# Altium schematic sheet LiPo_Charger.SchDoc: Printer
size 431 x 279 mm; Date: 2022; Author: Renaissance; CompanyName: Upenn-ESE516; DrawnBy: Xinyang Tan;  Yuxin Wang; Engineer: Xinyang Tan;  Yuxin Wang; Address1: 200 S 33 St; Address2: Moore Building, Rm 101; Address3: Philadephla, PA 19104; DocumentNumber: 4; Revision: 1.0; SheetNumber: 4; SheetTotal: 9
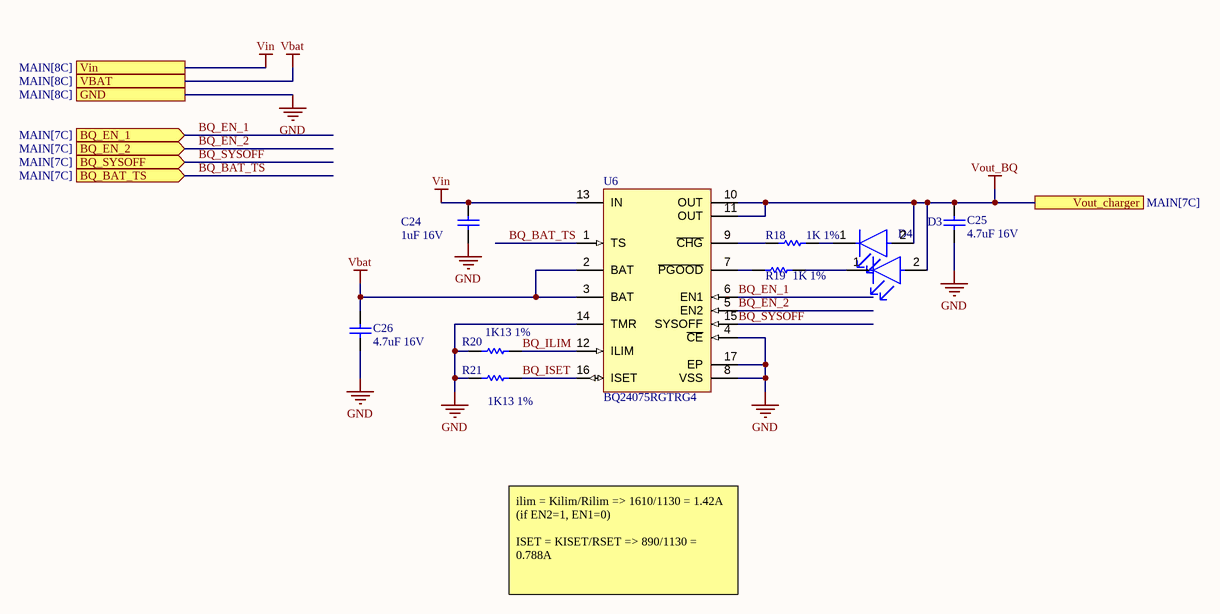
[diagram p0: LiPo_Charger.SchDoc]

## Parts
C24  1uF 16V  [CAPC1608X90X35NL15T15]
C25  4.7uF 16V  [CAPC0805(2012)145_N]
C26  4.7uF 16V  [CAPC0805(2012)145_N]
D3  LTST-C170CKT  [FP-LTST-C170CKT-MFG]  (value not drawn)
D4  LTST-C170GKT  [FP-LTST-C170GKT-MFG]  (value not drawn)
R18  1K 1%  [RESC1609X50X30NL10T20]
R19  1K 1%  [RESC1609X50X30NL10T20]
R20  1K13 1%  [RESC0603(1608)_N]
R21  1K13 1%  [RESC0603(1608)_N]
U6  BQ24075RGTRG4  [RGT16-1700X1700TP]

## Ports
BQ_BAT_TS (in, see MAIN[7C]), BQ_EN_1 (in, see MAIN[7C]), BQ_EN_2 (in, see MAIN[7C]), BQ_SYSOFF (in, see MAIN[7C]), GND (see MAIN[8C]), VBAT (see MAIN[8C]), Vin (see MAIN[8C]), Vout_charger (see MAIN[7C])

## Nets
GND: C24.1 C25.1 C26.2 R20.1 R21.1 U6.4(~{CE}) U6.8(VSS) U6.14(TMR) U6.17(EP) ; port GND
Vbat: C26.1 U6.2(BAT) U6.3(BAT) ; port VBAT
Vin: C24.2 U6.13(IN) ; port Vin
Vout_BQ: C25.2 D3.2(A) D4.2(A) U6.10(OUT) U6.11(OUT) ; port Vout_charger
BQ_BAT_TS: U6.1(TS) ; port BQ_BAT_TS
BQ_EN_1: U6.6(EN1) ; port BQ_EN_1
BQ_EN_2: U6.5(EN2) ; port BQ_EN_2
BQ_ILIM: R20.2 U6.12(ILIM)
BQ_ISET: R21.2 U6.16(ISET)
BQ_SYSOFF: U6.15(SYSOFF) ; port BQ_SYSOFF
NetD3_1: D3.1(C) R18.2
NetD4_1: D4.1(C) R19.2
NetR18_1: R18.1 U6.9(~{CHG})
NetR19_1: R19.1 U6.7(~{PGOOD})

## Notes on the sheet
- ilim = Kilim/Rilim => 1610/1130 = 1.42A (if EN2=1, EN1=0)
  ISET = KISET/RSET => 890/1130 = 0.788A
- DWG. NO.
- REV.
- SHT.
- THIS DOCUMENT AND THE DATA DISCLOSED HEREIN OR HEREWITH IS THE PROPERTY OF ALTIUM LIMITED AND MAY BE FREELY DISTRIBUTED IN WHOLE. NO RIGHTS ARE RESERVED OR EXPRESS OR IMPLIED WARANTEE GIVEN.
- REVISION
- DESCRIPTION
- DATE
- APPROVED
- ENG:
- APPROVALS
- PROJECT
- DSN:
- CHK:
- REFERENCE DOCUMENTS
- PROJECT REVISION:
- TITLE
- DOCUMENT REVISION:
- DESIGN ITEM:
- BOM:
- FAB DWG:
- PCB DWG:
- ASSY DWG:
- SCALE:
- SIZE
- B
- CAGE CODE
- FILE NAME
- DWG NO.
- SHEET
- OF
- REV

## Library data of the parts
C24 = CMP-1035-02736-2: Manufacturer: AVX Interconnect / Elco; Part Number: 0603YC105JAT2A
C25 C26 = CMP-1036-04893-1: CAP 4.7uF 16V -20% to +80% 0805 (2012 Metric) Thickness 1.45mm SMD; Case-Metric: 2012; Case-EIA: 0805; Max Thickness: 1.45 mm; Value: 4.7uF; Rated Voltage: 16 V; Tolerance: -20% to +80%; Technology: SMT
D3 = CMP-1674-00001-6: LED RED CLEAR SMD; Number of Elements: 1; Power Dissipation: 100mW; Lens Color: Colorless; Voltage: 5V; Wavelength: 660nm; Viewing Angle: 130°; Forward Current: 40mA; Luminous Intensity: 10mcd; Forward Voltage: 1.8V; Test Current: 10mA; Dominant Wavelength: 638nm; Lens Style: Diffused; Package Quantity: 1; Packaging: Tape and Reel; Max Operating Temperature: 85°C; Min Operating Temperature: -55°C; Mount: Surface Mount; Length: 2mm; Height: 1.1mm; Case/Package: 0805; Radiation Hardening: No; Illumination Color: Red; Max Power Dissipation: 100mW; Reverse Voltage: 5V; Lead Free: Lead Free; Color: Red; Case Code (Imperial): 0805; Case Code (Metric): 2012; Power Rating: 100mW; Lens Transparency: Clear; Number of LEDs: 1; Number of Pins: 2; Depth: 1.25mm; Width: 1.25mm
D4 = CMP-1674-00002-6: LED GREEN CLEAR SMD; Dominant Wavelength: 569nm; Lens Style: Diffused; Forward Voltage: 2.1V; Number of Elements: 1; Wavelength: 565nm; Luminous Intensity: 6mcd; Test Current: 10mA; Power Dissipation: 100mW; Reverse Voltage: 5V; Forward Current: 30mA; Viewing Angle: 130°; Lens Color: Colorless; Height: 1.1mm; Package Quantity: 1; Packaging: Tape and Reel; Mount: Surface Mount; Min Operating Temperature: -55°C; Max Operating Temperature: 85°C; Length: 2mm; Number of Pins: 2; Color: Green; Radiation Hardening: No; Illumination Color: Green; Case Code (Metric): 2012; Lens Transparency: Clear; Case/Package: 0805; Width: 1.25mm; Case Code (Imperial): 0805; Depth: 1.25mm; Power Rating: 100mW; Lead Free: Lead Free; Number of LEDs: 1; Voltage: 5V
R18 R19 = CMP-1012-00510-2: Manufacturer: Vishay Dale; Part Number: CRCW06031K00FKEB
R20 R21 = CMP-1012-00515-1: 1K13 0.1W 1% 0603 (1608 Metric)  SMD; Value: 1130.00 Ohm; Case-EIA: 0603; Case-Metric: 1608; Power: 0.1 W; Tolerance: 1 %; Technology: SMT
U6 = CMP-0321-00237-1: USB-Friendly Li-Ion Battery Charger and Power-Path Management IC, Vout 5.5 V, 4.3 V, -40 to 85 degC, 16-pin QFN (RGT), Green (RoHS & no Sb/Br); Manufacturer: Texas Instruments; Li-Ion: N; SubFamily: Battery Charge Management; Vin(Min)(V): 4.3; ComponentLink1URL: http://www.ti.com/general/docs/lit/getliterature.tsp?genericPartNumber=BQ24075&fileType=pdf; Over Voltage Protection: N; PackageDescription: 16-Pin Plastic Quad Flat No-Lead, 3 x 3 mm Body, 0.5 mm Pitch, 1.7 x 1.7 mm Exposed Pad; NiMH: N; Li-Polymer: N; Eco-Plan: Green (RoHS & no Sb/Br); Code_JEDEC: MO-220; Lead Acid: N; PartNumber: BQ24075RGTRG4; ComponentLink1Description: Datasheet; Mounting Technology: Surface Mount; PackageVersion: revH, Oct-2011; PackageReference: RGT16-1700X1700TP; NiCd: N; DatasheetVersion: SLUS810G